# EasyEDA Pro project ModuleBtnMatrix25sw.epro

# Schematic Main
Board Name: Board1; Create Date: 2025-06-28; Page Name: P1; Project Name: Module25Switches_TH_matrix; Schematic Name: Main; Update Date: 2025-06-28; Company: EasyEDA.com; Page Size: A4; Version: V1.0
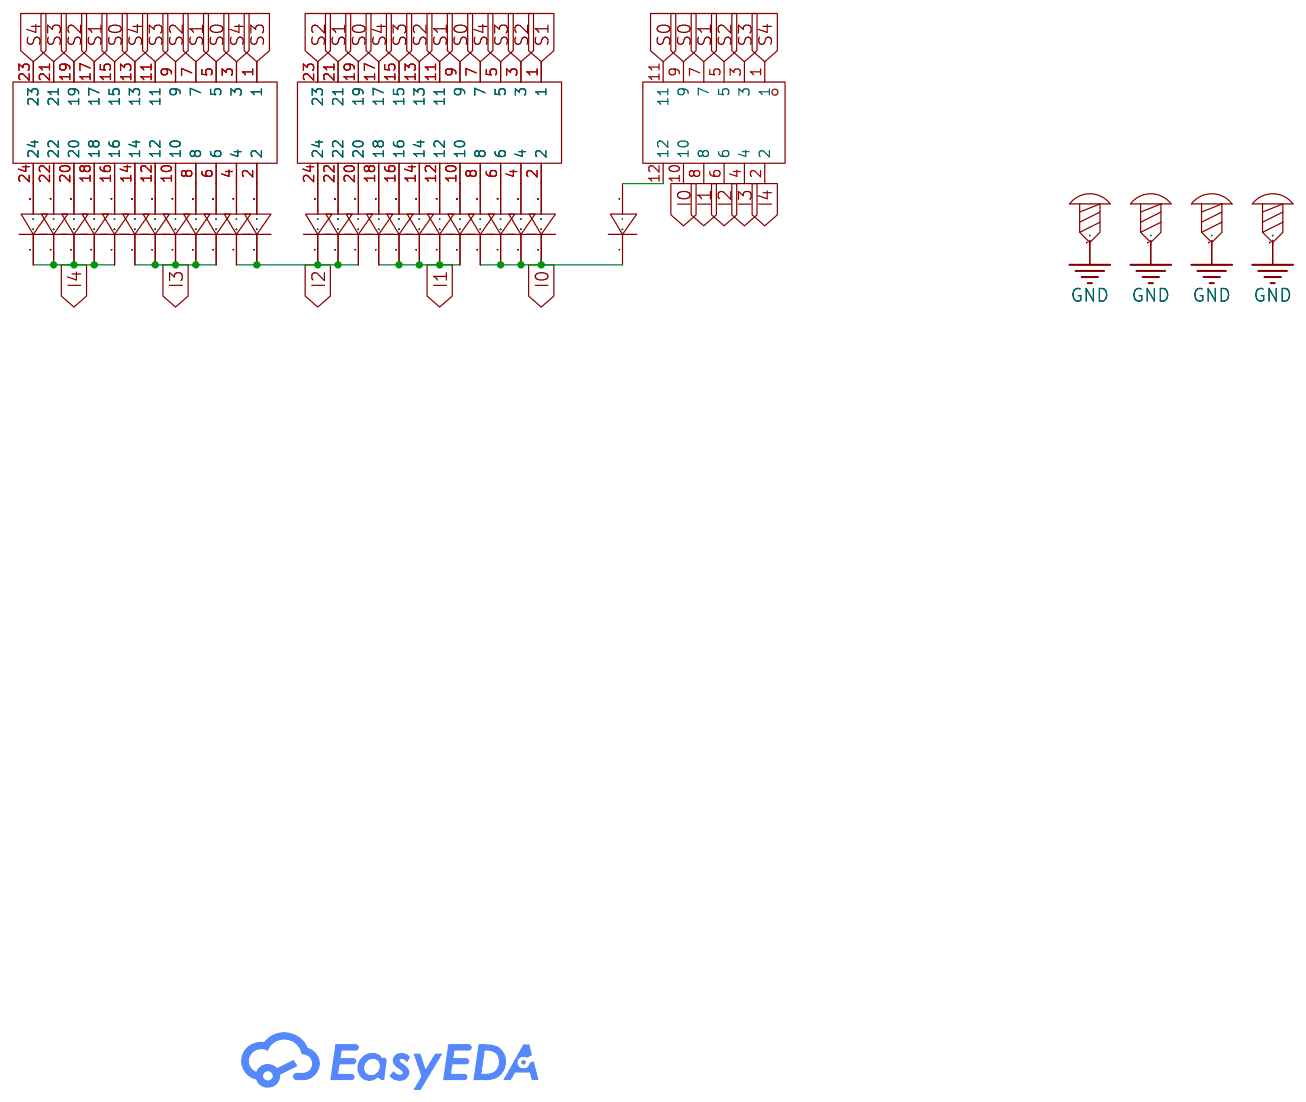
[diagram p0: schematic sheet]

## Parts
D1  1N4148  [DIODE_TH_2P]  (no BOM)
D14  1N4148  [DIODE_TH_2P]  (no BOM)
D15  1N4148  [DIODE_TH_2P]  (no BOM)
D16  1N4148  [DIODE_TH_2P]  (no BOM)
D17  1N4148  [DIODE_TH_2P]  (no BOM)
D18  1N4148  [DIODE_TH_2P]  (no BOM)
D19  1N4148  [DIODE_TH_2P]  (no BOM)
D20  1N4148  [DIODE_TH_2P]  (no BOM)
D21  1N4148  [DIODE_TH_2P]  (no BOM)
D22  1N4148  [DIODE_TH_2P]  (no BOM)
D23  1N4148  [DIODE_TH_2P]  (no BOM)
D24  1N4148  [DIODE_TH_2P]  (no BOM)
D25  1N4148  [DIODE_TH_2P]  (no BOM)
D26  1N4148  [DIODE_TH_2P]  (no BOM)
D27  1N4148  [DIODE_TH_2P]  (no BOM)
D28  1N4148  [DIODE_TH_2P]  (no BOM)
D29  1N4148  [DIODE_TH_2P]  (no BOM)
D30  1N4148  [DIODE_TH_2P]  (no BOM)
D31  1N4148  [DIODE_TH_2P]  (no BOM)
D32  1N4148  [DIODE_TH_2P]  (no BOM)
D33  1N4148  [DIODE_TH_2P]  (no BOM)
D34  1N4148  [DIODE_TH_2P]  (no BOM)
D35  1N4148  [DIODE_TH_2P]  (no BOM)
D36  1N4148  [DIODE_TH_2P]  (no BOM)
D37  1N4148  [DIODE_TH_2P]  (no BOM)
SCREW1  -  [Screw-Hole-M2]  (no BOM)
SCREW2  -  [Screw-Hole-M2]  (no BOM)
SCREW3  -  [Screw-Hole-M2]  (no BOM)
SCREW4  -  [Screw-Hole-M2]  (no BOM)
U1  2541WR-2x12P  [HDR-TH_24P-P2.54-H-M-R2-C12-S2.54-N]  (no BOM)
U2  2541WR-2x12P  [HDR-TH_24P-P2.54-H-M-R2-C12-S2.54-N]  (no BOM)
U4  2541WR-2x06P  [HDR-TH_12P-P2.54-H-M-R2-C6-S2.54-N]  (no BOM)

## Library data of the parts
D1 D14-D37 = 1N4148_C402212: Diode Configuration:- Voltage - Forward(Vf@If):1V@10mA Voltage - DC Reverse(Vr): Current - Rectified: Reverse Leakage Current (Ir):5uA@75V Reverse Recovery Time (trr): Operating Temperature:- Operating Temperature:-; Supplier Part: C402212; Manufacturer: LGE(鲁光); Supplier Footprint: DO-35; JLCPCB Part Class: Extended Part; Datasheet: https://atta.szlcsc.com/upload/public/pdf/source/20190705/C402212_D6CD0A8EA8714742E0940C7C02C37BFA.pdf; Supplier: LCSC; Voltage - Forward(Vf@If): 1V@10mA; Reverse Leakage Current (Ir): 5uA@75V
SCREW1-SCREW4 = Screw-Hole-M2: Supplier Footprint: 插件
U1 U2 = 2541WR-2x12P: Pin Structure:2x12P Pitch:2.54mm Circluar Pins/Square Pins:Policy Mounting Type:Right-Angle Number of Rows:Double Row Number of Pins:24P Length of Mating Pin:6mm Insulation Height:2.5mm Contact Plating:Gold Operating Temperature:-40℃~+105℃ Operating Tempe; LCSC Part Name: 2x12P 间距:2.54mm 方针 弯插; Supplier Part: C5383094; Manufacturer: HanElectricity(瀚源); Supplier Footprint: 弯插,P=2.54mm; JLCPCB Part Class: Extended Part; Datasheet: https://atta.szlcsc.com/upload/public/pdf/source/20230330/FE4D889090FF16F85128307BD79BAA8F.pdf; Supplier: LCSC; Pin Structure: 2x12P; Pitch: 2.54mm; Circluar Pins/Square Pins: Policy; Mounting Type: Right-Angle; Number of Rows: Double Row; Number of Pins: 24P; Length of Mating Pin: 6mm; Insulation Height: 2.5mm; Contact Plating: Gold; Operating Temperature: -40℃~+105℃
U4 = 2541WR-2x06P: Pin Structure:2x6P Pitch:2.54mm Circluar Pins/Square Pins:Policy Mounting Type:Right-Angle Number of Rows:Double Row Number of Pins:12P Length of Mating Pin:6mm Insulation Height:2.5mm Contact Plating:Gold Operating Temperature:-40℃~+105℃ Operating Temper; LCSC Part Name: 2x6P 间距:2.54mm 方针 弯插; Supplier Part: C5383091; Manufacturer: HanElectricity(瀚源); Supplier Footprint: 弯插,P=2.54mm; JLCPCB Part Class: Extended Part; Datasheet: https://atta.szlcsc.com/upload/public/pdf/source/20230330/FE4D889090FF16F85128307BD79BAA8F.pdf; Supplier: LCSC; Pin Structure: 2x6P; Pitch: 2.54mm; Circluar Pins/Square Pins: Policy; Mounting Type: Right-Angle; Number of Rows: Double Row; Number of Pins: 12P; Length of Mating Pin: 6mm; Insulation Height: 2.5mm; Contact Plating: Gold; Operating Temperature: -40℃~+105℃

## Nets
GND: SCREW1.1 SCREW2.1 SCREW3.1 SCREW4.1
I0: D33.1(C) D34.1(C) D35.1(C) D36.1(C) D37.1(C) U4.10
I1: D28.1(C) D29.1(C) D30.1(C) D31.1(C) D32.1(C) U4.8
I2: D23.1(C) D24.1(C) D25.1(C) D26.1(C) D27.1(C) U4.6
I3: D18.1(C) D19.1(C) D20.1(C) D21.1(C) D22.1(C) U4.4
I4: D1.1(C) D14.1(C) D15.1(C) D16.1(C) D17.1(C) U4.2
S0: U1.5 U1.15 U2.9 U2.19 U4.9 U4.11
S1: U1.7 U1.17 U2.1 U2.11 U2.21 U4.7
S2: U1.9 U1.19 U2.3 U2.13 U2.23 U4.5
S3: U1.1 U1.11 U1.21 U2.5 U2.15 U4.3
S4: U1.3 U1.13 U1.23 U2.7 U2.17 U4.1
$1N1290: D1.2(A) U1.24
$1N2373: D14.2(A) U1.22
$1N2412: D15.2(A) U1.20
$1N2451: D16.2(A) U1.18
$1N2490: D17.2(A) U1.16
$1N2529: D18.2(A) U1.14
$1N2568: D19.2(A) U1.12
$1N2607: D20.2(A) U1.10
$1N2646: D21.2(A) U1.8
$1N2685: D22.2(A) U1.6
$1N2724: D23.2(A) U1.4
$1N2763: D24.2(A) U1.2
$1N2802: D25.2(A) U2.24
$1N2841: D26.2(A) U2.22
$1N2880: D27.2(A) U2.20
$1N2919: D28.2(A) U2.18
$1N2958: D29.2(A) U2.16
$1N2997: D30.2(A) U2.14
$1N3036: D31.2(A) U2.12
$1N3075: D32.2(A) U2.10
$1N3114: D33.2(A) U2.8
$1N3153: D34.2(A) U2.6
$1N3192: D35.2(A) U2.4
$1N3231: D36.2(A) U2.2
$1N4020: D37.2(A) U4.12

# Board PCB
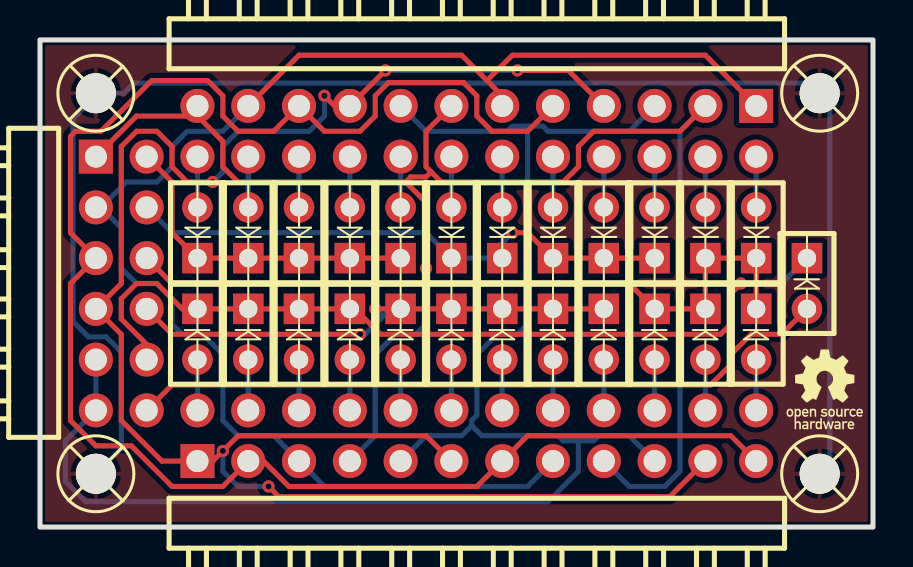
[diagram p1: board, top side]
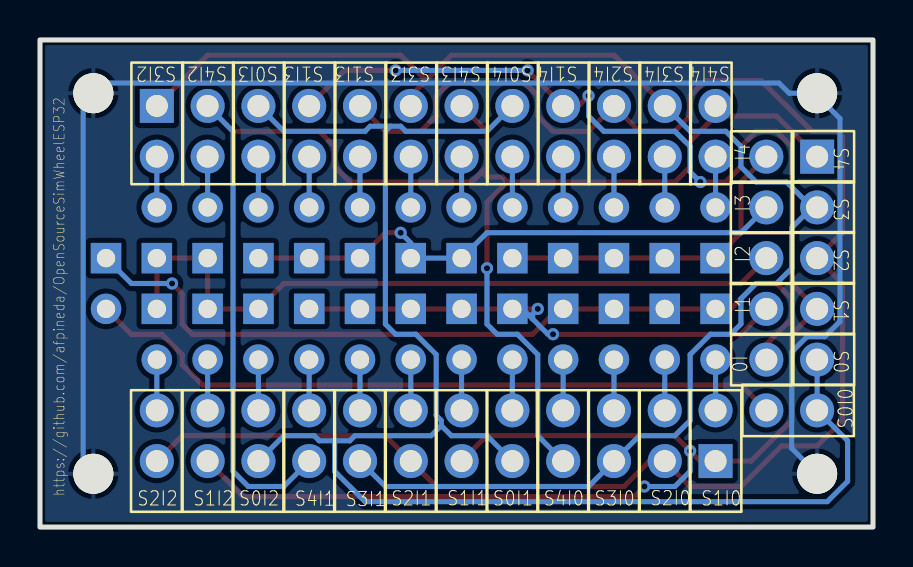
[diagram p2: board, bottom side, seen from below]

Outline 41.66 x 24.38 mm; copper layers: Top Layer, Bottom Layer. Coordinates in mm from the lower left corner of the outline.
Outline path: rectangle 0,24.38 41.66,0
Stack: Top Layer 0.035mm / Dielectric1 1.51mm FR4 er 4.5 / Bottom Layer 0.035mm

## Design rules (mm)
template: JLCPCB Capability(Two Layers Board)
spacing copperThickness1oz (default): track to track 0.102, other pairs 0.152 to 0.3
spacing copperThickness2oz: track to track 0.203, other pairs 0.152 to 0.3
track width copperThickness1oz (default): min 0.127, default 0.254, max 2.54
track width copperThickness2oz: min 0.203, default 0.254, max 2.54
differential pair differentialPair (default): width min 0.127, default 0.254, max 2.54; gap min 0.152, default 0.152
via viaSize (default): diameter min 0.5, default 0.61, max 10; hole min 0.3, default 0.305, max 6.3

## Placement (name value [footprint] x y rotation side)
D1  1N4148  [DIODE_TH_2P]  7.87 14.73 90 top
D14  1N4148  [DIODE_TH_2P]  10.41 14.73 90 top
D15  1N4148  [DIODE_TH_2P]  12.95 14.73 90 top
D16  1N4148  [DIODE_TH_2P]  15.49 14.73 90 top
D17  1N4148  [DIODE_TH_2P]  18.03 14.73 90 top
D18  1N4148  [DIODE_TH_2P]  20.57 14.73 90 top
D19  1N4148  [DIODE_TH_2P]  23.11 14.73 90 top
D20  1N4148  [DIODE_TH_2P]  25.65 14.73 90 top
D21  1N4148  [DIODE_TH_2P]  28.19 14.73 90 top
D22  1N4148  [DIODE_TH_2P]  30.73 14.73 90 top
D23  1N4148  [DIODE_TH_2P]  33.27 14.73 90 top
D24  1N4148  [DIODE_TH_2P]  35.81 14.73 90 top
D25  1N4148  [DIODE_TH_2P]  35.81 9.65 270 top
D26  1N4148  [DIODE_TH_2P]  33.27 9.65 270 top
D27  1N4148  [DIODE_TH_2P]  30.73 9.65 270 top
D28  1N4148  [DIODE_TH_2P]  28.19 9.65 270 top
D29  1N4148  [DIODE_TH_2P]  25.65 9.65 270 top
D30  1N4148  [DIODE_TH_2P]  23.11 9.65 270 top
D31  1N4148  [DIODE_TH_2P]  20.57 9.65 270 top
D32  1N4148  [DIODE_TH_2P]  18.03 9.65 270 top
D33  1N4148  [DIODE_TH_2P]  15.49 9.65 270 top
D34  1N4148  [DIODE_TH_2P]  12.95 9.65 270 top
D35  1N4148  [DIODE_TH_2P]  10.41 9.65 270 top
D36  1N4148  [DIODE_TH_2P]  7.87 9.65 270 top
D37  1N4148  [DIODE_TH_2P]  38.35 12.19 270 top
SCREW1  -  [Screw-Hole-M2]  38.99 2.67 0 top
SCREW2  -  [Screw-Hole-M2]  2.79 21.72 0 top
SCREW3  -  [Screw-Hole-M2]  38.99 21.72 0 top
SCREW4  -  [Screw-Hole-M2]  2.79 2.67 0 top
U1  2541WR-2x12P  [HDR-TH_24P-P2.54-H-M-R2-C12-S2.54-N]  21.84 19.81 180 top
U2  2541WR-2x12P  [HDR-TH_24P-P2.54-H-M-R2-C12-S2.54-N]  21.84 4.57 0 top
U4  2541WR-2x06P  [HDR-TH_12P-P2.54-H-M-R2-C6-S2.54-N]  4.06 12.19 270 top

## Footprints (pads in the part's own frame, mm; a bottom-side part is the same pattern mirrored in y, then rotated)
DIODE_TH_2P
  rect 1.524x1.524 hole 0.914: 1(-1.27,0)
  round 1.524 hole 0.914: 2(1.27,0)
HDR-TH_12P-P2.54-H-M-R2-C6-S2.54-N
  rect 1.7x1.7 hole 1.1: 1(-6.35,-1.27)
  round 1.7 hole 1.1: 2(-6.35,1.27) 3(-3.81,-1.27) 4(-3.81,1.27) 5(-1.27,-1.27) 6(-1.27,1.27) 7(1.27,-1.27) 8(1.27,1.27) 9(3.81,-1.27) 10(3.81,1.27) 11(6.35,-1.27) 12(6.35,1.27)
HDR-TH_24P-P2.54-H-M-R2-C12-S2.54-N
  rect 1.7x1.7 hole 1.1: 1(-13.97,-1.27)
  round 1.7 hole 1.1: 2(-13.97,1.27) 3(-11.43,-1.27) 4(-11.43,1.27) 5(-8.89,-1.27) 6(-8.89,1.27) 7(-6.35,-1.27) 8(-6.35,1.27) 9(-3.81,-1.27) 10(-3.81,1.27) 11(-1.27,-1.27) 12(-1.27,1.27) 13(1.27,-1.27) 14(1.27,1.27) 15(3.81,-1.27) 16(3.81,1.27) 17(6.35,-1.27) 18(6.35,1.27) 19(8.89,-1.27) 20(8.89,1.27) 21(11.43,-1.27) 22(11.43,1.27) 23(13.97,-1.27) 24(13.97,1.27)
Screw-Hole-M2
  round 2 hole 2: 1(0,0)

## Nets
As in the schematic.

## Via types
v1: diameter 0.61, hole 0.305, Top Layer to Bottom Layer, 11 vias

## Routing (per net, layer and track width the routed paths; a pad name or vN(x,y) marks a point on that pad's centre or on a via; arc(x,y) is an arc through that point)
GND: length 77.7
  Bottom Layer w0.254: 2.92,21.72 1.65,20.45 1.65,10.29 2.41,9.53 3.3,9.53 4.06,8.76 4.06,3.94 SCREW4.1 ; 2.92,21.72 SCREW2.1 ; 2.92,21.72 4.19,21.72 4.7,22.23 38.48,22.23 SCREW3.1 39.5,21.21 39.5,3.17 SCREW1.1
I0: length 41.7
  Top Layer w0.254: v1(35.05,12.19) 34.54,11.68 34.54,10.16 34.04,9.65 17.02,9.65 15.75,10.92 D33.1 D34.1 D35.1 D36.1 7.11,10.92 5.84,12.19 4.83,12.19 4.06,11.43 4.06,10.41 5.33,9.14 U4.10
  Bottom Layer w0.254: D37.1 37.08,12.19 v1(35.05,12.19)
I1: length 25.8
  Top Layer w0.254: v1(16.76,10.92) D32.1 D31.1 D30.1 D29.1 D28.1 ; U4.8 6.6,9.65 v1(16,9.65)
  Bottom Layer w0.254: v1(16.76,10.92) 17.02,10.67 17.02,10.41 ; 17.02,10.41 17.53,10.92 D32.1 ; 17.02,10.41 16.26,9.65 v1(16,9.65)
I2: length 36.6
  Top Layer w0.254: U4.6 6.6,12.19 29.46,12.19 D27.1 D26.1 D23.1 D24.1 D25.1
I3: length 28
  Top Layer w0.254: v1(23.62,14.73) 24.38,14.73 D20.1 D21.1 D22.1
  Bottom Layer w0.254: v1(23.62,14.73) 23.11,14.22 D19.1 D18.1 19.3,14.73 6.6,14.73 U4.4
I4: length 16.3
  Top Layer w0.254: D17.1 D16.1 D15.1 D14.1 D1.1 6.6,14.73 6.6,17.27 U4.2
S0: length 80.1
  Bottom Layer w0.254: 26.92,4.32 27.69,4.32 27.94,4.57 29.46,4.57 U2.19 ; 26.92,4.32 26.92,2.79 25.4,1.27 2.29,1.27 1.27,2.29 1.27,4.32 U4.11 U4.9 ; 26.92,4.32 26.16,4.32 25.91,4.57 22.1,4.57 21.59,5.08 ; U1.5 29.46,19.81 25.4,19.81 25.15,20.07 24.13,20.07 ; U2.9 19.3,4.57 21.08,4.57 21.59,5.08 ; 21.59,5.08 21.59,5.33 21.84,5.59 21.84,8.64 22.86,9.65 23.88,9.65 24.38,10.16 24.38,19.81 24.13,20.07 ; 24.13,20.07 23.62,20.07 23.37,19.81 19.3,19.81 U1.15
S1: length 90.5
  Top Layer w0.254: U2.11 19.3,4.57 9.91,4.57 v1(9.14,3.81) 8.64,3.3 U2.1 6.1,3.3 4.06,5.33 4.06,9.65 U4.7 4.06,12.19 4.06,19.05 4.83,19.81 5.84,19.81 6.6,19.05 6.6,18.03 7.37,17.27 v1(8.64,17.27) ; U2.21 31.5,1.52 11.94,1.52 v1(11.43,2.03) ; U1.7 26.42,22.86 v1(23.88,22.86) ; v1(17.27,22.86) U1.17 14.73,21.08 v1(14.22,21.59)
  Bottom Layer w0.254: v1(11.43,2.03) 9.91,2.03 9.14,2.79 v1(9.14,3.81) ; v1(23.88,22.86) v1(17.27,22.86) ; v1(14.22,21.59) 14.22,20.57 13.46,19.81 9.91,19.81 9.14,19.05 9.14,17.78 v1(8.64,17.27)
S2: length 85.3
  Top Layer w0.254: U2.23 34.54,4.57 24.38,4.57 U2.13 21.84,2.03 12.45,2.03 11.18,3.3 U2.3 9.14,2.03 6.6,2.03 4.57,4.06 2.79,4.06 1.52,5.33 1.52,12.19 U4.5 1.52,14.73 1.52,19.56 1.78,19.81 3.05,19.81 5.59,22.35 8.38,22.35 9.14,21.59 9.14,20.57 9.91,19.81 11.68,19.81 U1.19 14.22,19.81 16,19.81 16.76,20.57 16.76,21.59 17.42,22.25 21.18,22.25 21.84,21.59 21.84,20.57 22.61,19.81 24.38,19.81 U1.9
S3: length 73.2
  Top Layer w0.254: U1.11 23.11,21.59 22.35,22.35 ; 22.35,22.35 21.08,23.62 12.95,23.62 U1.21 ; 22.35,22.35 23.62,23.62 33.27,23.62 U1.1
  Bottom Layer w0.254: 3.05,16 4.06,14.99 4.06,12.95 4.83,12.19 5.84,12.19 6.6,11.43 6.6,10.16 7.11,9.65 8.13,9.65 9.14,8.64 9.14,5.33 9.91,4.57 11.68,4.57 U2.5 14.22,2.03 24.38,2.03 U2.15 ; 3.05,16 U4.3 ; 3.05,16 4.32,17.27 5.84,17.27 6.6,18.03 6.6,19.05 7.37,19.81 9.14,19.81 U1.21
S4: length 80.5
  Top Layer w0.254: 19.56,17.78 19.3,18.03 19.3,19.81 U1.13 ; 19.56,17.78 20.07,17.27 26.16,17.27 26.92,18.03 26.92,19.05 27.69,19.81 32,19.81 U1.3 ; 19.56,17.78 19.3,17.53 18.54,17.53 18.29,17.27 ; U4.1 4.83,20.57 7.87,20.57 ; 18.29,17.27 9.91,17.27 9.14,18.03 9.14,19.3 7.87,20.57 ; 18.29,17.27 19.3,16.26 v1(19.3,12.95) ; 7.87,20.57 U1.23
  Bottom Layer w0.254: v1(19.3,12.95) 19.3,10.16 18.8,9.65 17.78,9.65 16.76,8.64 16.76,4.57 U2.7 ; U2.17 29.46,2.03 31.24,2.03 32,2.79 32,19.81 U1.3
$1N1290: length 2.5
  Bottom Layer w0.254: U1.24 D1.2
$1N2373: length 2.5
  Bottom Layer w0.254: U1.22 D14.2
$1N2412: length 2.5
  Bottom Layer w0.254: U1.20 D15.2
$1N2451: length 2.5
  Bottom Layer w0.254: U1.18 D16.2
$1N2490: length 2.5
  Bottom Layer w0.254: U1.16 D17.2
$1N2529: length 2.5
  Bottom Layer w0.254: U1.14 D18.2
$1N2568: length 2.5
  Bottom Layer w0.254: U1.12 D19.2
$1N2607: length 2.5
  Bottom Layer w0.254: U1.10 D20.2
$1N2646: length 2.5
  Bottom Layer w0.254: U1.8 D21.2
$1N2685: length 2.5
  Bottom Layer w0.254: U1.6 D22.2
$1N2724: length 2.5
  Bottom Layer w0.254: U1.4 D23.2
$1N2763: length 2.5
  Bottom Layer w0.254: U1.2 D24.2
$1N2802: length 2.5
  Bottom Layer w0.254: U2.24 D25.2
$1N2841: length 2.5
  Bottom Layer w0.254: U2.22 D26.2
$1N2880: length 2.5
  Bottom Layer w0.254: U2.20 D27.2
$1N2919: length 2.5
  Bottom Layer w0.254: U2.18 D28.2
$1N2958: length 2.5
  Bottom Layer w0.254: U2.16 D29.2
$1N2997: length 2.5
  Bottom Layer w0.254: U2.14 D30.2
$1N3036: length 2.5
  Bottom Layer w0.254: U2.12 D31.2
$1N3075: length 2.5
  Bottom Layer w0.254: U2.10 D32.2
$1N3114: length 2.5
  Bottom Layer w0.254: U2.8 D33.2
$1N3153: length 2.5
  Bottom Layer w0.254: U2.6 D34.2
$1N3192: length 2.5
  Bottom Layer w0.254: U2.4 D35.2
$1N3231: length 2.5
  Bottom Layer w0.254: U2.2 D36.2
$1N4020: length 35.4
  Top Layer w0.254: D37.2 37.08,9.65 35.56,9.65 34.54,8.64 34.54,8.13 33.53,7.11 6.6,7.11 U4.12

## Copper pours and planes (outline as drawn; the poured copper is in the pictures)
GND on Top Layer: 0,24.38 41.66,24.38 41.66,0 0,0
GND on Bottom Layer: 0,24.38 41.66,24.38 41.66,0 0,0

## Text on the board
Bottom Silkscreen Layer: https://github.com/afpineda/OpenSourceSimWheelESP32 | I4 | I3 | I2 | I1 | I0 | S3 | S2 | S1 | S0 | S4 | S1I0 | S2I0 | S3I0 | S4I0 | S0I1 | S1I1 | S2I1 | S3I1 | S4I1 | S0I2 | S1I2 | S2I2 | S4I4 | S3I4 | S2I4 | S1I4 | S0I4 | S4I3 | S3I3 | S1I3 | S0I3 | S4I2 | S3I2 | S0I0
